# EAGLE board singleboard (EAGLE 6.6.0), part 1 of 2
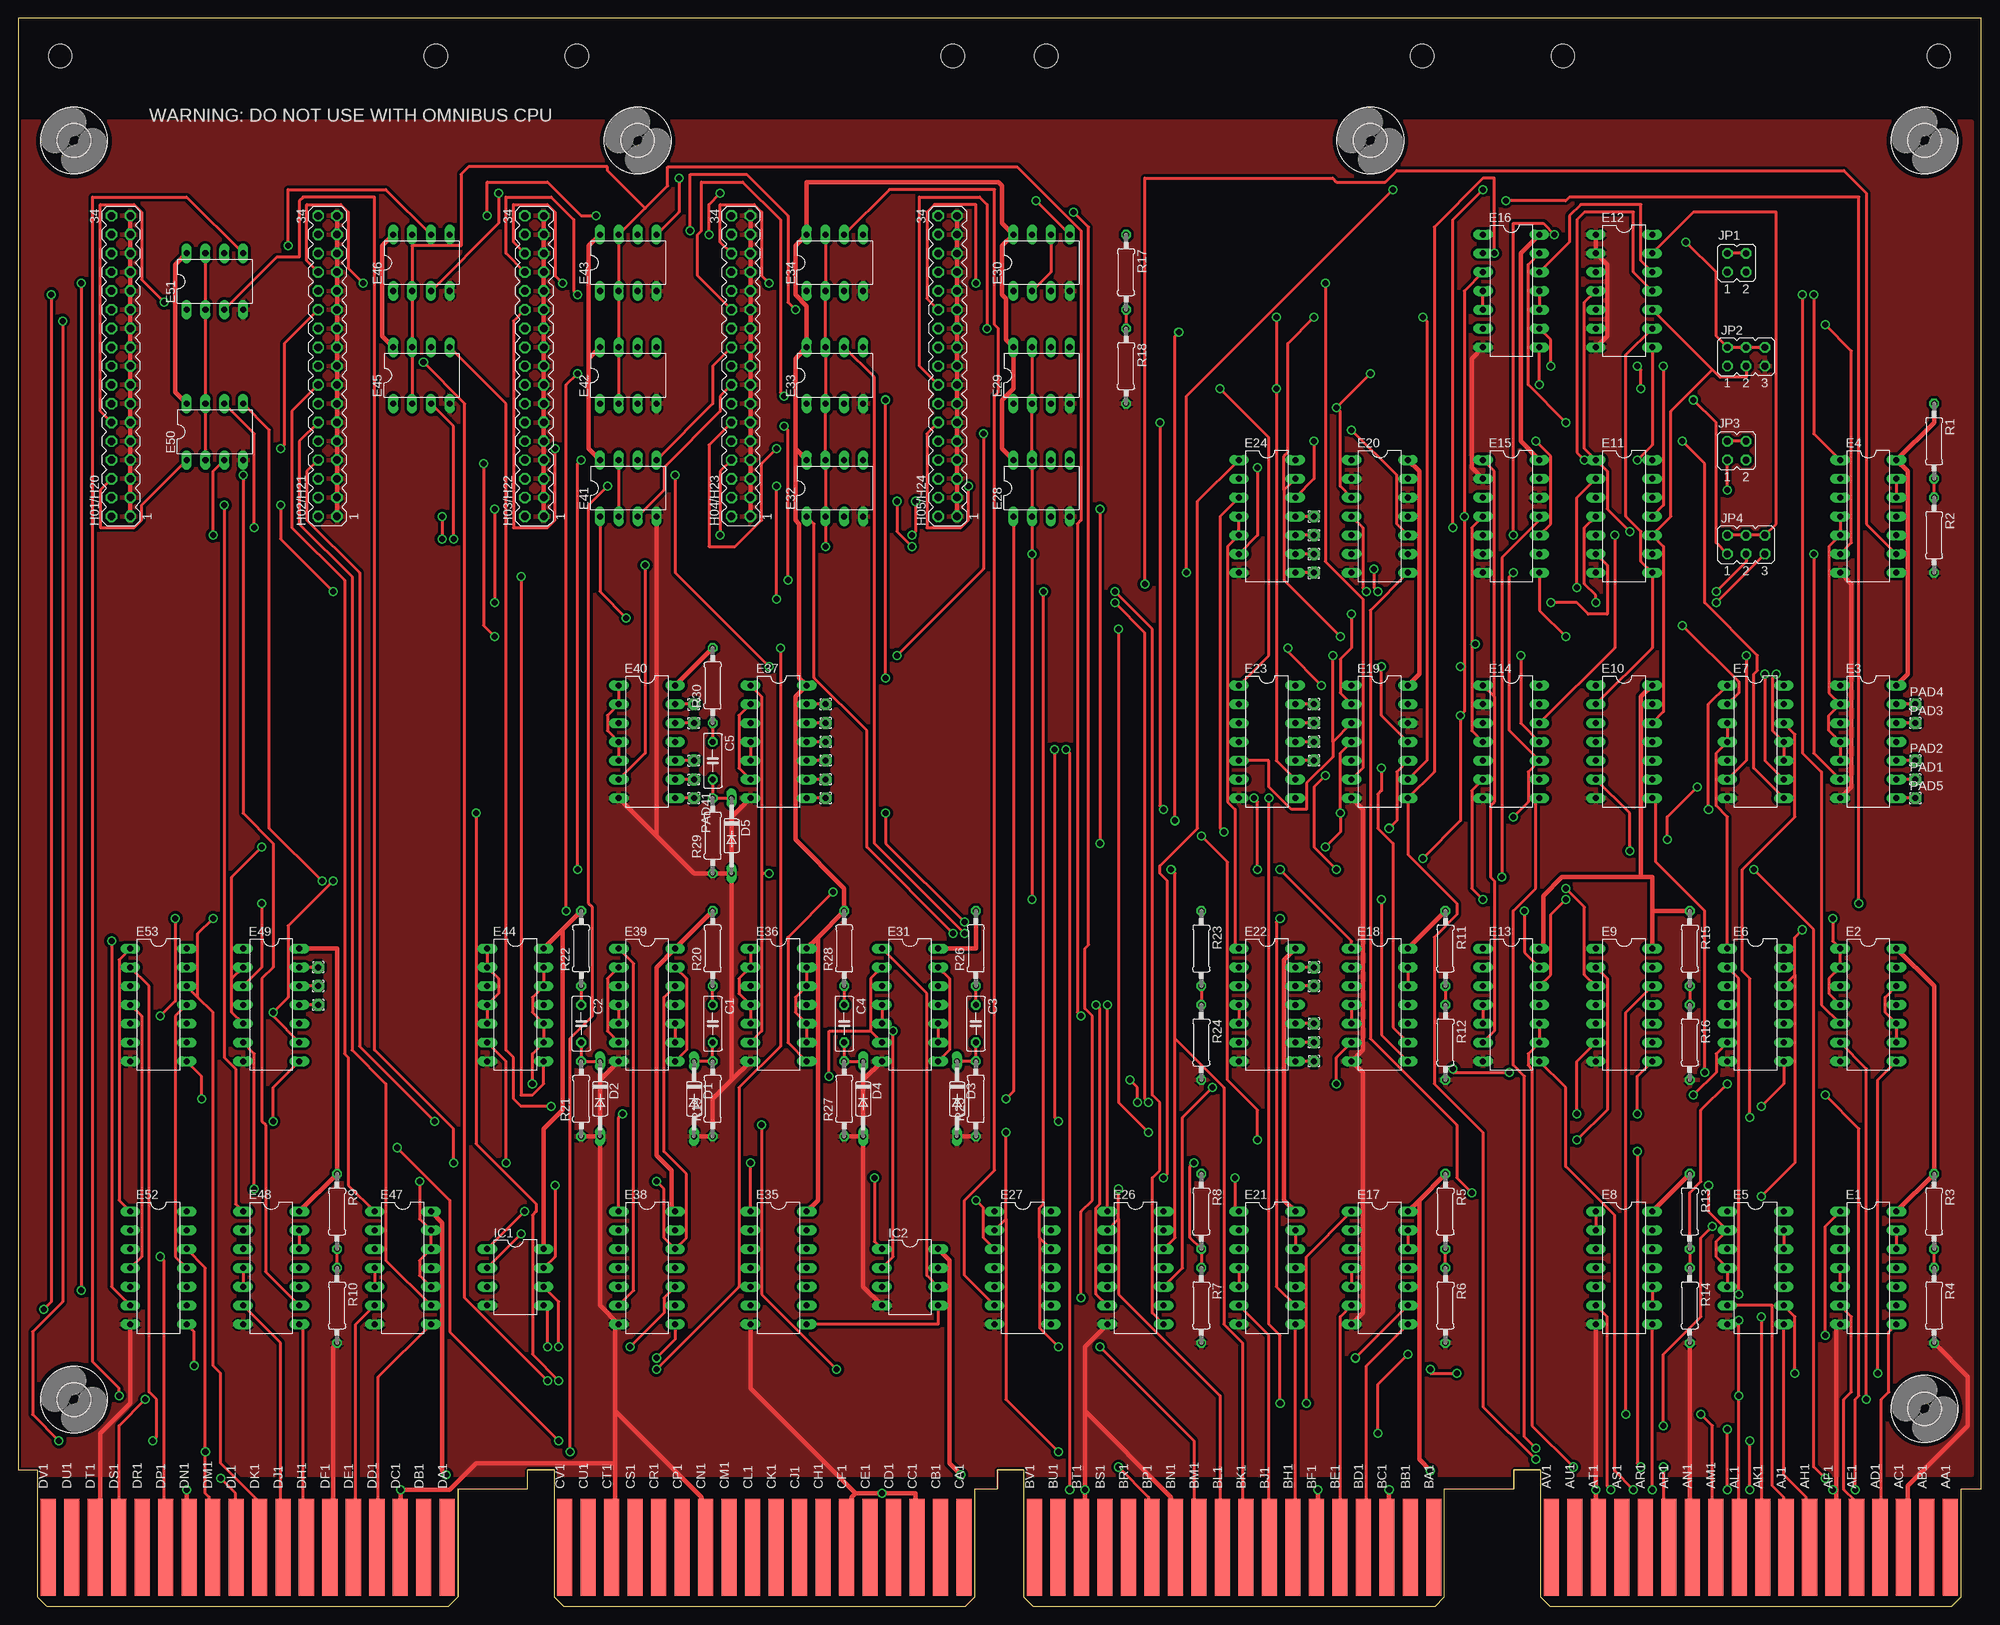
[diagram p5: board, top side]
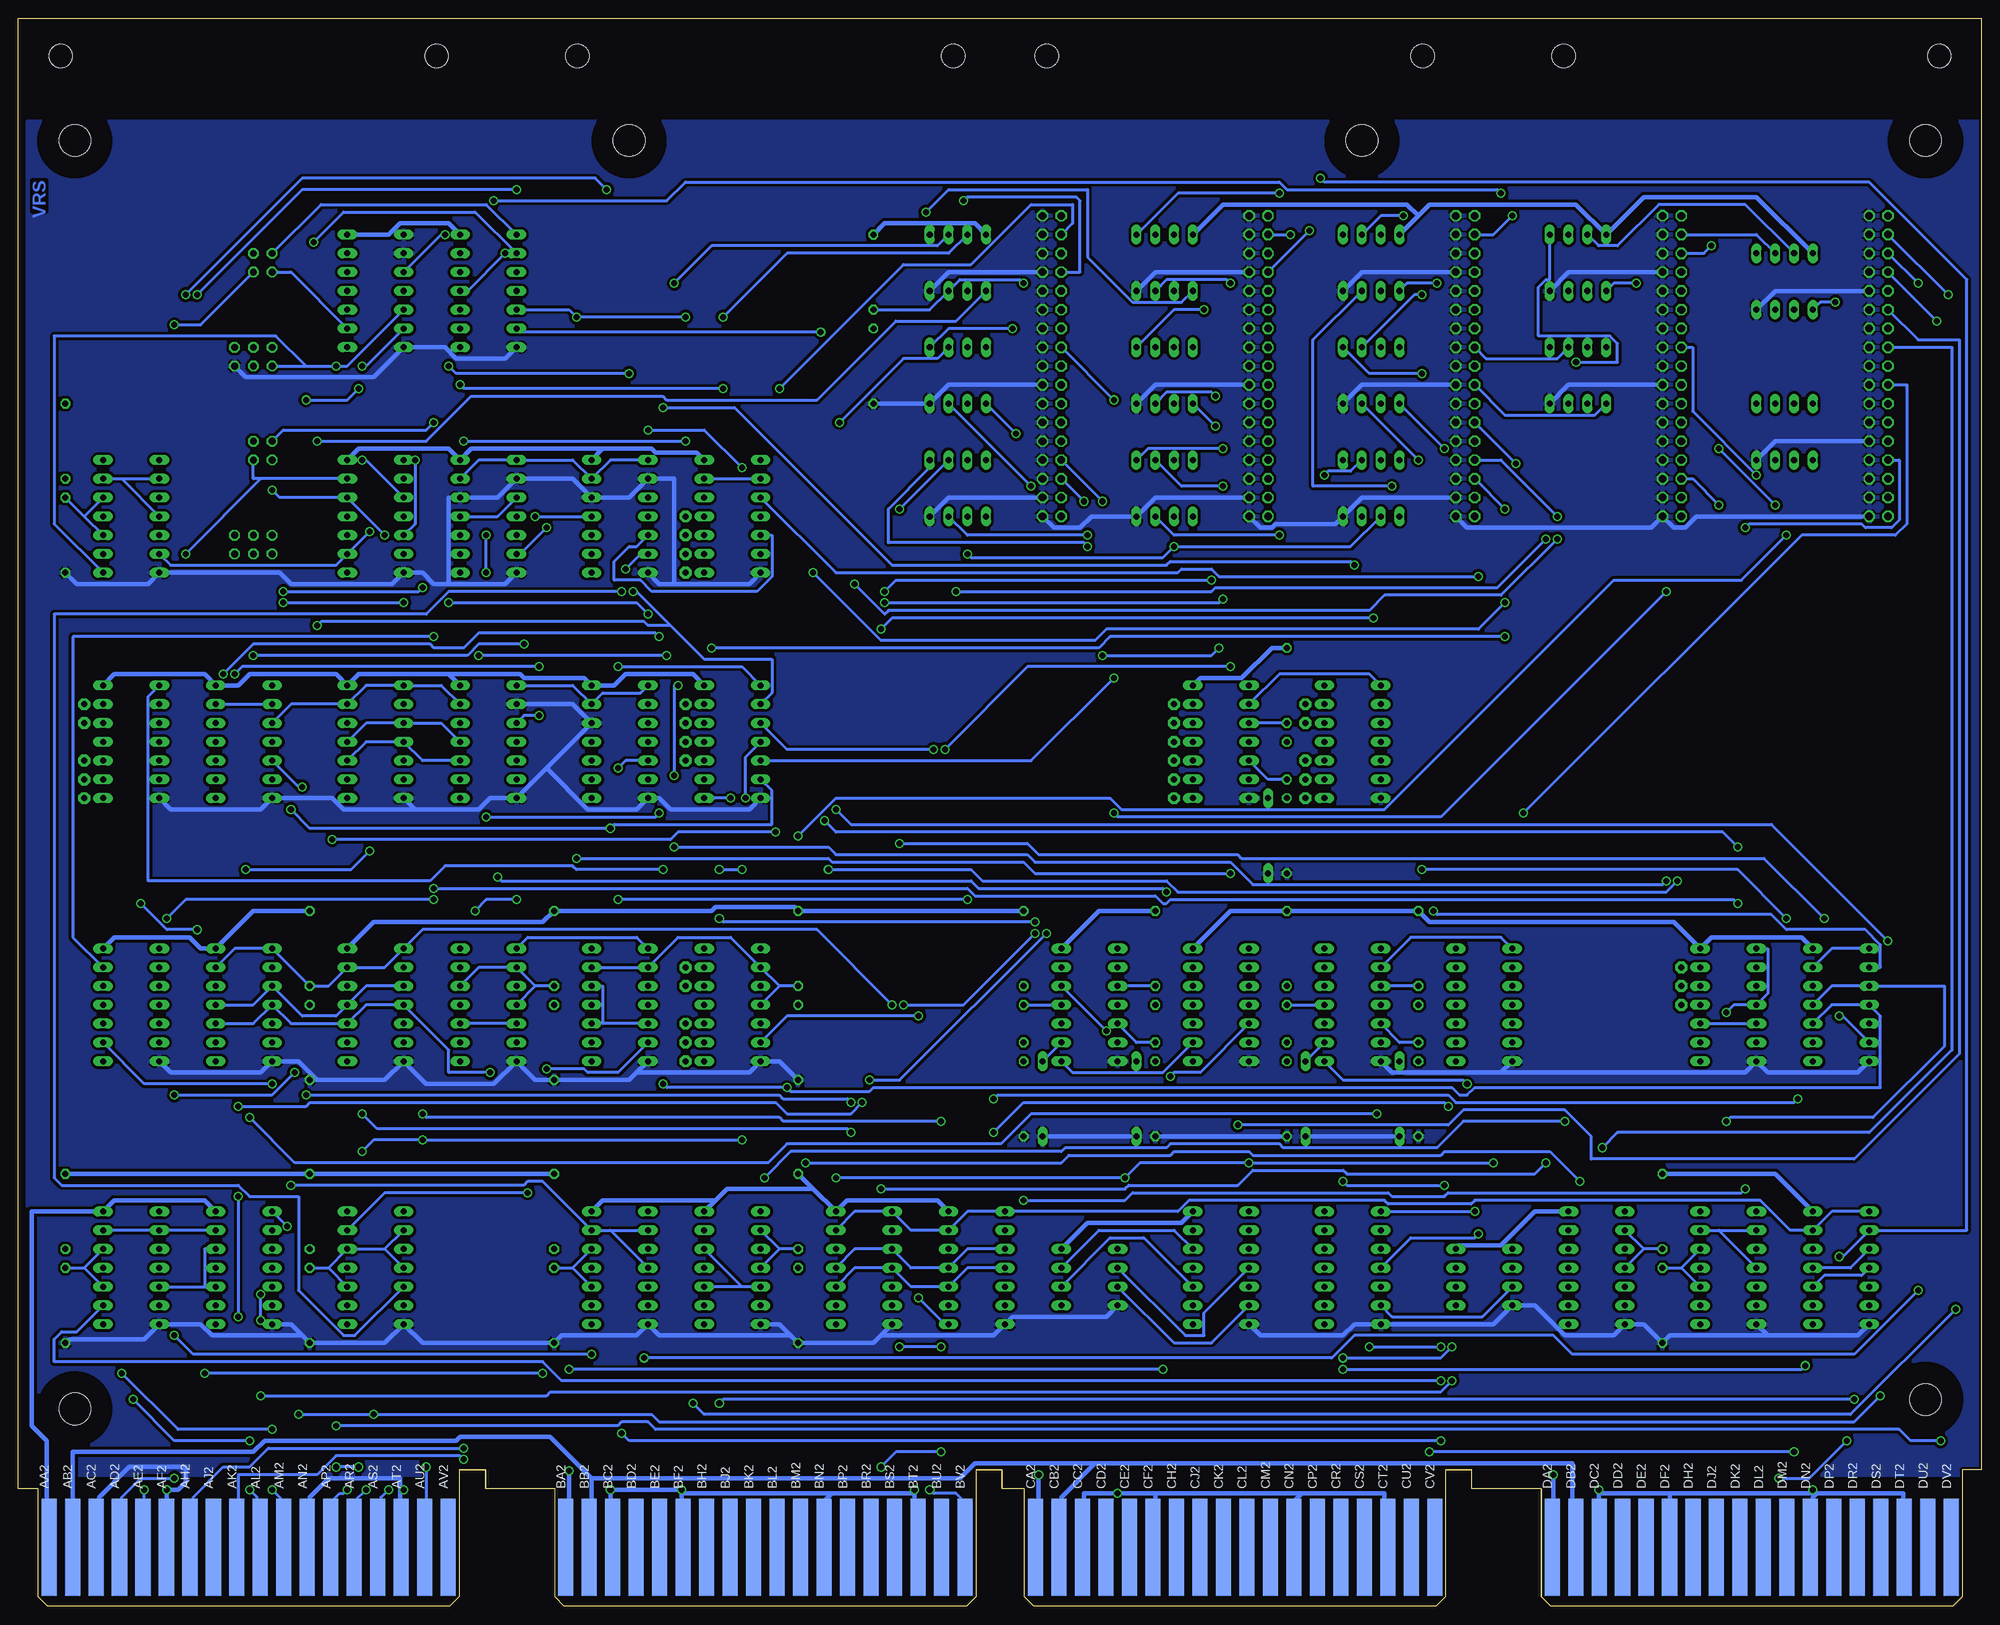
[diagram p6: board, bottom side, seen from below]

Size 265.3 x 214.63 mm. Coordinates in mm from the lower left corner, seen from the top.
Copper layers (1+16): Top 0.035mm / dielectric 1.5mm / Bottom 0.035mm
Design rules "16mils *": minimum track width 16mil, minimum drill 32mil, track to track 15mil, track to pad 10mil, pad to pad 10mil, via to via 10mil, smd to smd 10mil, copper to edge 13mil, drill to drill 10mil, minimum pad ring 10mil, minimum via ring 8mil, stop-mask expansion 0mil, vias tented up to drill 0mil, thermal gap 10mil
Net classes: 1 Power: width 0.635 mm
tRestrict: area -0.1,203.2 to 264,213.4
bRestrict: area -0.1,203.2 to 264,213.4

## Footprints (pad centres in the part's own frame; a part is rotated, then mirrored left to right if it is on the bottom)
C050-025X075 = drill 0.813 octagon: 1 -2.54,0; 2 2.54,0
DO35-10 = drill 0.813 long: A 5.08,0; C -5.08,0
DIL14 = drill 0.813 long: 1 -7.62,-3.81; 2 -5.08,-3.81; 3 -2.54,-3.81; 4 0,-3.81; 5 2.54,-3.81; 6 5.08,-3.81; 7 7.62,-3.81; 8 7.62,3.81; 9 5.08,3.81; 10 2.54,3.81; 11 0,3.81; 12 -2.54,3.81; 13 -5.08,3.81; 14 -7.62,3.81
DIL08 = drill 0.813 long: 1 -3.81,-3.81; 2 -1.27,-3.81; 3 1.27,-3.81; 4 3.81,-3.81; 5 3.81,3.81; 6 1.27,3.81; 7 -1.27,3.81; 8 -3.81,3.81
MA17-2 = drill 1.016 octagon: 1 -20.32,-1.27; 2 -20.32,1.27; 3 -17.78,-1.27; 4 -17.78,1.27; 5 -15.24,-1.27; 6 -15.24,1.27; 7 -12.7,-1.27; 8 -12.7,1.27; 9 -10.16,-1.27; 10 -10.16,1.27; 11 -7.62,-1.27; 12 -7.62,1.27; 13 -5.08,-1.27; 14 -5.08,1.27; 15 -2.54,-1.27; 16 -2.54,1.27; 17 0,-1.27; 18 0,1.27; 19 2.54,-1.27; 20 2.54,1.27; 21 5.08,-1.27; 22 5.08,1.27; 23 7.62,-1.27; 24 7.62,1.27; 25 10.16,-1.27; 26 10.16,1.27; 27 12.7,-1.27; 28 12.7,1.27; 29 15.24,-1.27; 30 15.24,1.27; 31 17.78,-1.27; 32 17.78,1.27; 33 20.32,-1.27; 34 20.32,1.27
JP2Q = drill 0.914 octagon: 1 -1.27,-1.27; 2 -1.27,1.27; 3 1.27,-1.27; 4 1.27,1.27
JP3Q = drill 0.914 octagon: 1 -2.54,-1.27; 2 -2.54,1.27; 3 0,-1.27; 4 0,1.27; 5 2.54,-1.27; 6 2.54,1.27
1,6/0,8 = drill 0.813 pad 1.6 octagon: 1 0,0
0207/10 = drill 0.813 octagon: 1 -5.08,0; 2 5.08,0
EDGE-CON8 = smd 2.032 x 13.106: AA1 261.303,7.938; AB1 258.127,7.938; AC1 254.952,7.938; AD1 251.778,7.938; AE1 248.602,7.938; AF1 245.428,7.938; AH1 242.252,7.938; AJ1 239.077,7.938; AK1 235.903,7.938; AL1 232.727,7.938; AM1 229.553,7.938; AN1 226.377,7.938; AP1 223.202,7.938; AR1 220.028,7.938; AS1 216.852,7.938; AT1 213.678,7.938; AU1 210.502,7.938; AV1 207.327,7.938; BA1 191.452,7.938; BB1 188.278,7.938; BC1 185.102,7.938; BD1 181.928,7.938; BE1 178.752,7.938; BF1 175.577,7.938; BH1 172.403,7.938; BJ1 169.227,7.938; BK1 166.053,7.938; BL1 162.877,7.938; BM1 159.702,7.938; BN1 156.528,7.938; BP1 153.352,7.938; BR1 150.178,7.938; BS1 147.002,7.938; BT1 143.827,7.938; BU1 140.653,7.938; BV1 137.477,7.938; CA1 127.953,7.938; CB1 124.778,7.938; CC1 121.603,7.938; CD1 118.427,7.938; CE1 115.252,7.938; CF1 112.078,7.938; CH1 108.903,7.938; CJ1 105.728,7.938; CK1 102.552,7.938; CL1 99.377,7.938; CM1 96.203,7.938; CN1 93.028,7.938; CP1 89.853,7.938; CR1 86.677,7.938; CS1 83.502,7.938; CT1 80.328,7.938; CU1 77.153,7.938; CV1 73.978,7.938; DA1 58.102,7.938; DB1 54.928,7.938; DC1 51.752,7.938; DD1 48.578,7.938; DE1 45.403,7.938; DF1 42.227,7.938; DH1 39.053,7.938; DJ1 35.877,7.938; DK1 32.703,7.938; DL1 29.527,7.938; DM1 26.352,7.938; DN1 23.177,7.938; DP1 20.003,7.938; DR1 16.828,7.938; DS1 13.652,7.938; DT1 10.477,7.938; DU1 7.303,7.938; DV1 4.128,7.938 | smd 2.032 x 13.106 bottom: AA2 261.303,7.938; AB2 258.127,7.938; AC2 254.952,7.938; AD2 251.778,7.938; AE2 248.602,7.938; AF2 245.428,7.938; AH2 242.252,7.938; AJ2 239.077,7.938; AK2 235.903,7.938; AL2 232.727,7.938; AM2 229.553,7.938; AN2 226.377,7.938; AP2 223.202,7.938; AR2 220.028,7.938; AS2 216.852,7.938; AT2 213.678,7.938; AU2 210.502,7.938; AV2 207.327,7.938; BA2 191.452,7.938; BB2 188.278,7.938; BC2 185.102,7.938; BD2 181.928,7.938; BE2 178.752,7.938; BF2 175.577,7.938; BH2 172.403,7.938; BJ2 169.227,7.938; BK2 166.053,7.938; BL2 162.877,7.938; BM2 159.702,7.938; BN2 156.528,7.938; BP2 153.352,7.938; BR2 150.178,7.938; BS2 147.002,7.938; BT2 143.827,7.938; BU2 140.653,7.938; BV2 137.477,7.938; CA2 127.953,7.938; CB2 124.778,7.938; CC2 121.603,7.938; CD2 118.427,7.938; CE2 115.252,7.938; CF2 112.078,7.938; CH2 108.903,7.938; CJ2 105.728,7.938; CK2 102.552,7.938; CL2 99.377,7.938; CM2 96.203,7.938; CN2 93.028,7.938; CP2 89.853,7.938; CR2 86.677,7.938; CS2 83.502,7.938; CT2 80.328,7.938; CU2 77.153,7.938; CV2 73.978,7.938; DA2 58.102,7.938; DB2 54.928,7.938; DC2 51.752,7.938; DD2 48.578,7.938; DE2 45.403,7.938; DF2 42.227,7.938; DH2 39.053,7.938; DJ2 35.877,7.938; DK2 32.703,7.938; DL2 29.527,7.938; DM2 26.352,7.938; DN2 23.177,7.938; DP2 20.003,7.938; DR2 16.828,7.938; DS2 13.652,7.938; DT2 10.477,7.938; DU2 7.303,7.938; DV2 4.128,7.938
OMNIBUS = hole 3.175: 208.915,209.55; 259.715,209.55; 189.865,209.55; 139.065,209.55; 75.616,209.55; 126.416,209.55; 56.566,209.55; 5.766,209.55
4,3 = hole 4.3: 0,0

## Placement (x,y rotation side)
C1  .22uf  [C050-025X075]  93.85,78.74 270 top
C2  .22uf  [C050-025X075]  76.07,78.74 270 top
C3  .22uf  [C050-025X075]  129.41,78.74 270 top
C4  .22uf  [C050-025X075]  111.63,78.74 270 top
C5  .22uf  [C050-025X075]  93.85,114.3 270 top
D1  D664  [DO35-10]  91.31,68.58 270 top
D2  D664  [DO35-10]  78.61,68.58 270 top
D3  D664  [DO35-10]  126.87,68.58 270 top
D4  D664  [DO35-10]  114.17,68.58 270 top
D5  D664  [DO35-10]  96.39,104.14 270 top
E1  74H40  [DIL14]  250.06,45.72 270 top
E2  74H40  [DIL14]  250.06,81.28 270 top
E3  74H40  [DIL14]  250.06,116.84 270 top
E4  74H40  [DIL14]  250.06,147.32 270 top
E5  74H40  [DIL14]  234.82,45.72 270 top
E6  74S74N  [DIL14]  234.82,81.28 270 top
E7  7410N  [DIL14]  234.82,116.84 270 top
E8  74H40  [DIL14]  217.04,45.72 270 top
E9  74S74N  [DIL14]  217.04,81.28 270 top
E10  74S74N  [DIL14]  217.04,116.84 270 top
E11  7404N  [DIL14]  217.04,147.32 270 top
E12  7400N  [DIL14]  217.04,177.8 270 top
E13  74H40  [DIL14]  201.8,81.28 270 top
E14  74S74N  [DIL14]  201.8,116.84 270 top
E15  74S74N  [DIL14]  201.8,147.32 270 top
E16  7410N  [DIL14]  201.8,177.8 270 top
E17  74H40  [DIL14]  184.02,45.72 270 top
E18  74H40  [DIL14]  184.02,81.28 270 top
E19  74S74N  [DIL14]  184.02,116.84 270 top
E20  74S74N  [DIL14]  184.02,147.32 270 top
E21  74H40  [DIL14]  168.78,45.72 270 top
E22  74H40  [DIL14]  168.78,81.28 270 top
E23  7404N  [DIL14]  168.78,116.84 270 top
E24  7410N  [DIL14]  168.78,147.32 270 top
E26  74S74N  [DIL14]  151,45.72 270 top
E27  74S74N  [DIL14]  135.76,45.72 270 top
E28  DS75453N  [DIL08]  138.3,151.13 0 top
E29  DS75453N  [DIL08]  138.3,166.37 0 top
E30  DS75453N  [DIL08]  138.3,181.61 0 top
E31  7400N  [DIL14]  120.52,81.28 270 top
E32  DS75453N  [DIL08]  110.36,151.13 0 top
E33  DS75453N  [DIL08]  110.36,166.37 0 top
E34  DS75453N  [DIL08]  110.36,181.61 0 top
E35  DS1005-250  [DIL14]  102.74,45.72 270 top
E36  74H40  [DIL14]  102.74,81.28 270 top
E37  7400N  [DIL14]  102.74,116.84 270 top
E38  DS1005-250  [DIL14]  84.96,45.72 270 top
E39  7400N  [DIL14]  84.96,81.28 270 top
E40  74H40  [DIL14]  84.96,116.84 270 top
E41  DS75453N  [DIL08]  82.42,151.13 0 top
E42  DS75453N  [DIL08]  82.42,166.37 0 top
E43  DS75453N  [DIL08]  82.42,181.61 0 top
E44  74H40  [DIL14]  67.18,81.28 270 top
E45  DS75453N  [DIL08]  54.48,166.37 0 top
E46  DS75453N  [DIL08]  54.48,181.61 0 top
E47  74H40  [DIL14]  51.94,45.72 270 top
E48  74H40  [DIL14]  34.16,45.72 270 top
E49  7400N  [DIL14]  34.16,81.28 270 top
E50  DS75453N  [DIL08]  26.54,158.75 0 top
E51  DS75453N  [DIL08]  26.54,179.07 0 top
E52  74S74N  [DIL14]  18.92,45.72 270 top
E53  74S74N  [DIL14]  18.92,81.28 270 top
H01/H20  [MA17-2]  13.84,167.64 90 top
H02/H21  [MA17-2]  41.78,167.64 90 top
H03/H22  [MA17-2]  69.72,167.64 90 top
H04/H23  [MA17-2]  97.66,167.64 90 top
H05/H24  [MA17-2]  125.6,167.64 90 top
IC1  DS1100M-250  [DIL08]  67.18,44.45 270 top
IC2  DS1100M-250  [DIL08]  120.52,44.45 270 top
JP1  [JP2Q]  232.28,181.61 0 top
JP2  [JP3Q]  233.55,168.91 0 top
JP3  [JP2Q]  232.28,156.21 0 top
JP4  [JP3Q]  233.55,143.51 0 top
PAD1  [1,6/0,8]  256.41,111.76 0 top
PAD2  [1,6/0,8]  256.41,114.3 0 top
PAD3  [1,6/0,8]  256.41,119.38 0 top
PAD4  [1,6/0,8]  256.41,121.92 0 top
PAD5  [1,6/0,8]  256.41,109.22 0 top
PAD12  [1,6/0,8]  175.13,116.84 0 top
PAD13  [1,6/0,8]  175.13,114.3 0 top
PAD14  [1,6/0,8]  175.13,121.92 0 top
PAD15  [1,6/0,8]  175.13,119.38 0 top
PAD16  [1,6/0,8]  175.13,76.2 0 top
PAD17  [1,6/0,8]  175.13,78.74 0 top
PAD18  [1,6/0,8]  175.13,83.82 0 top
PAD19  [1,6/0,8]  175.13,86.36 0 top
PAD20  [1,6/0,8]  175.13,73.66 0 top
PAD27  [1,6/0,8]  175.13,142.24 180 top
PAD28  [1,6/0,8]  175.13,144.78 180 top
PAD29  [1,6/0,8]  175.13,147.32 180 top
PAD30  [1,6/0,8]  175.13,139.7 180 top
PAD31  [1,6/0,8]  109.09,111.76 0 top
PAD32  [1,6/0,8]  109.09,114.3 0 top
PAD33  [1,6/0,8]  109.09,109.22 0 top
PAD34  [1,6/0,8]  109.09,119.38 0 top
PAD35  [1,6/0,8]  109.09,121.92 0 top
PAD36  [1,6/0,8]  109.09,116.84 0 top
PAD37  [1,6/0,8]  91.31,111.76 180 top
PAD38  [1,6/0,8]  91.31,114.3 180 top
PAD39  [1,6/0,8]  91.31,119.38 180 top
PAD40  [1,6/0,8]  91.31,121.92 180 top
PAD41  [1,6/0,8]  91.31,109.22 270 top
PAD42  [1,6/0,8]  40.51,83.82 0 top
PAD43  [1,6/0,8]  40.51,86.36 0 top
PAD44  [1,6/0,8]  40.51,81.28 0 top
R1  330  [0207/10]  258.95,157.48 270 top
R2  750  [0207/10]  258.95,144.78 270 top
R3  330  [0207/10]  258.95,53.34 270 top
R4  750  [0207/10]  258.95,40.64 270 top
R5  330  [0207/10]  192.91,53.34 270 top
R6  750  [0207/10]  192.91,40.64 270 top
R7  750  [0207/10]  159.89,40.64 270 top
R8  330  [0207/10]  159.89,53.34 270 top
R9  330  [0207/10]  43.05,53.34 270 top
R10  750  [0207/10]  43.05,40.64 270 top
R11  330  [0207/10]  192.91,88.9 270 top
R12  750  [0207/10]  192.91,76.2 270 top
R13  330  [0207/10]  225.93,53.34 270 top
R14  750  [0207/10]  225.93,40.64 270 top
R15  330  [0207/10]  225.93,88.9 270 top
R16  750  [0207/10]  225.93,76.2 270 top
R17  330  [0207/10]  149.73,180.34 270 top
R18  750  [0207/10]  149.73,167.64 270 top
R19  330  [0207/10]  93.85,68.58 90 top
R20  330  [0207/10]  93.85,88.9 90 top
R21  330  [0207/10]  76.07,68.58 90 top
R22  330  [0207/10]  76.07,88.9 90 top
R23  330  [0207/10]  159.89,88.9 270 top
R24  750  [0207/10]  159.89,76.2 270 top
R25  330  [0207/10]  129.41,68.58 90 top
R26  330  [0207/10]  129.41,88.9 90 top
R27  330  [0207/10]  111.63,68.58 90 top
R28  330  [0207/10]  111.63,88.9 90 top
R29  330  [0207/10]  93.85,104.14 90 top
R30  330  [0207/10]  93.85,124.46 90 top
U$1  [EDGE-CON8]  -0.13,0 0 top
U$2  OUTLINE-OMNIBUS  [OMNIBUS]  -0.13,0 0 top
U$20  [4,3]  257.68,198.12 270 top
U$66  [4,3]  83.69,198.12 270 top
U$67  [4,3]  182.75,198.12 270 top
U$82  [4,3]  257.68,26.67 270 top
U$83  [4,3]  7.49,27.94 270 top
U$86  [4,3]  7.49,198.12 270 top